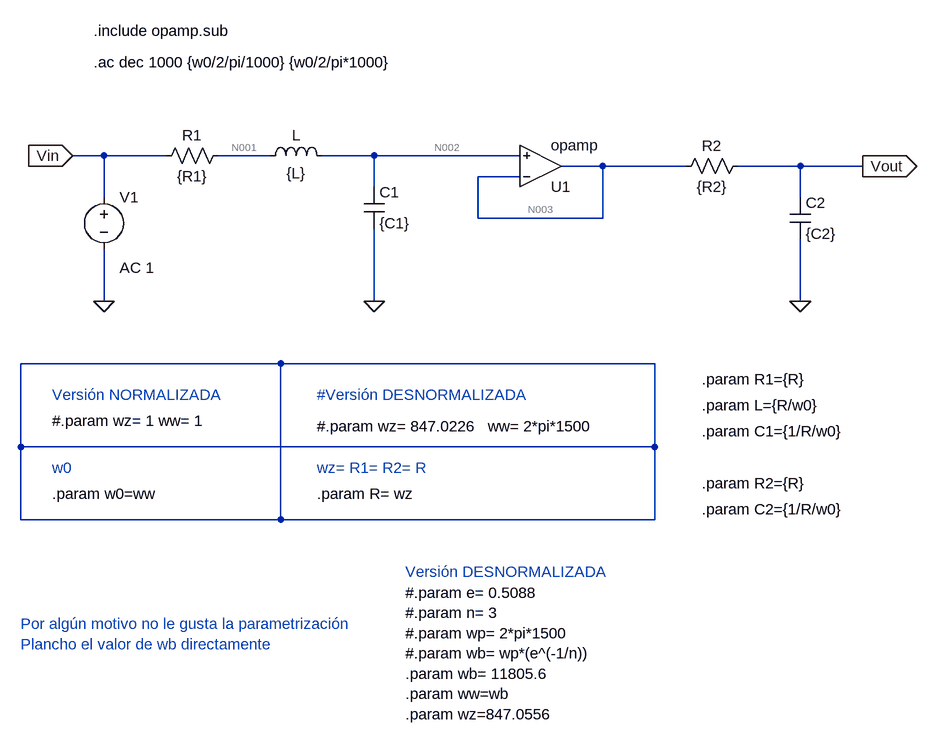
[diagram p0: schematic TS3_LTSpice_Butterworth.asc]
TS3_LTSpice_Butterworth.asc, the LTspice schematic file:
Version 4
SHEET 1 1836 888
WIRE -400 -208 -448 -208
WIRE -304 -208 -400 -208
WIRE -144 -208 -224 -208
WIRE 16 -208 -64 -208
WIRE 240 -208 16 -208
WIRE 368 -192 304 -192
WIRE 496 -192 368 -192
WIRE 672 -192 576 -192
WIRE 768 -192 672 -192
WIRE 240 -176 176 -176
WIRE 16 -160 16 -208
WIRE -400 -144 -400 -208
WIRE 672 -144 672 -192
WIRE 176 -112 176 -176
WIRE 368 -112 368 -192
WIRE 368 -112 176 -112
WIRE -400 16 -400 -64
WIRE 16 16 16 -96
WIRE 672 16 672 -80
WIRE -128 112 -528 112
WIRE 448 112 -128 112
WIRE -528 240 -528 112
WIRE 448 240 448 112
WIRE 448 240 -528 240
WIRE -528 352 -528 240
WIRE -128 352 -128 112
WIRE -128 352 -528 352
WIRE 448 352 448 240
WIRE 448 352 -128 352
FLAG 16 16 0
FLAG -400 16 0
FLAG -448 -208 Vin
IOPIN -448 -208 In
FLAG 672 16 0
FLAG 768 -192 Vout
IOPIN 768 -192 Out
SYMBOL Opamps\\opamp 272 -128 M180
SYMATTR InstName U1
SYMBOL res -208 -224 R90
WINDOW 0 0 56 VBottom 2
WINDOW 3 32 56 VTop 2
SYMATTR InstName R1
SYMATTR Value {R1}
SYMBOL cap 0 -160 R0
SYMATTR InstName C1
SYMATTR Value {C1}
SYMBOL res 592 -208 R90
WINDOW 0 0 56 VBottom 2
WINDOW 3 32 56 VTop 2
SYMATTR InstName R2
SYMATTR Value {R2}
SYMBOL cap 656 -144 R0
SYMATTR InstName C2
SYMATTR Value {C2}
SYMBOL voltage -400 -160 R0
WINDOW 123 24 124 Left 2
WINDOW 39 0 0 Left 0
SYMATTR Value2 AC 1
SYMATTR InstName V1
SYMATTR Value ""
SYMBOL ind -160 -192 R270
WINDOW 0 32 56 VTop 2
WINDOW 3 5 56 VBottom 2
SYMATTR InstName L
SYMATTR Value {L}
TEXT -416 -400 Left 2 !.include opamp.sub
TEXT -416 -352 Left 2 !.ac dec 1000 {w0/2/pi/1000} {w0/2/pi*1000}
TEXT -480 160 Left 2 ;Versión NORMALIZADA
TEXT -480 200 Left 2 !#.param wz= 1 ww= 1
TEXT -72 160 Left 2 ;#Versión DESNORMALIZADA
TEXT -72 208 Left 2 !#.param wz= 847.0226   ww= 2*pi*1500
TEXT 520 216 Left 2 !.param C1={1/R/w0}
TEXT -480 272 Left 2 ;w0
TEXT -480 312 Left 2 !.param w0=ww
TEXT -72 272 Left 2 ;wz= R1= R2= R
TEXT -72 312 Left 2 !.param R= wz
TEXT 520 336 Left 2 !.param C2={1/R/w0}
TEXT 520 136 Left 2 !.param R1={R}
TEXT 520 296 Left 2 !.param R2={R}
TEXT 520 176 Left 2 !.param L={R/w0}
TEXT 64 464 Left 2 !#.param e= 0.5088\n#.param n= 3\n#.param wp= 2*pi*1500\n#.param wb= wp*(e^(-1/n))\n.param wb= 11805.6\n.param ww=wb \n.param wz=847.0556
TEXT 64 432 Left 2 ;Versión DESNORMALIZADA
TEXT -528 512 Left 2 ;Por algún motivo no le gusta la parametrización\nPlancho el valor de wb directamente

The netlist it stands for:
* TS3_LTSpice_Butterworth.asc
XU1 N003 N002 N003 opamp Aol=100K GBW=10Meg  ; pins invin noninvin out
R1 N001 Vin {R1}
C1 N002 0 {C1}
R2 Vout N003 {R2}
C2 Vout 0 {C2}
V1 Vin 0 AC 1
L N001 N002 {L}
.include opamp.sub
.ac dec 1000 {w0/2/pi/1000} {w0/2/pi*1000}
* Versión NORMALIZADA
#.param wz= 1 ww= 1
* #Versión DESNORMALIZADA
#.param wz= 847.0226   ww= 2*pi*1500
.param C1={1/R/w0}
* w0
.param w0=ww
* wz= R1= R2= R
.param R= wz
.param C2={1/R/w0}
.param R1={R}
.param R2={R}
.param L={R/w0}
#.param e= 0.5088
#.param n= 3
#.param wp= 2*pi*1500
#.param wb= wp*(e^(-1/n))
.param wb= 11805.6
.param ww=wb
.param wz=847.0556
* Versión DESNORMALIZADA
* Por algún motivo no le gusta la parametrización
* Plancho el valor de wb directamente
.backanno
.end

* Results of the author's LTspice run, read from the files saved beside the schematic
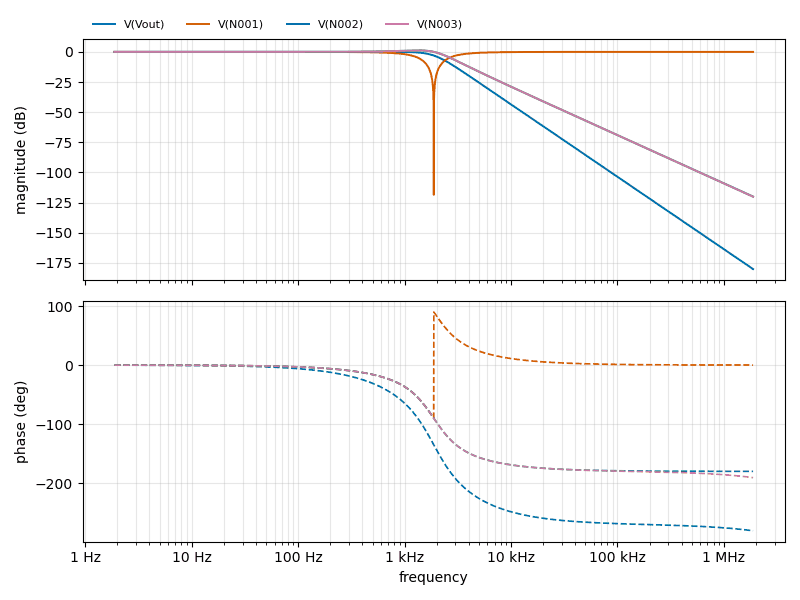
[diagram p1: AC Analysis of TS3_LTSpice_Butterworth.asc, plotted from the saved traces]
* AC Analysis, 1 run:
*   V(Vout): -0.00 dB at 1.879 Hz, -180.15 dB at 1.879 MHz, peak -0.00 dB at 1.879 Hz, 3 dB below the peak at 1.879 kHz
*   V(N001): -0.00 dB at 1.879 Hz, -0.00 dB at 1.879 MHz, peak -0.00 dB at 1.879 Hz, 3 dB below the peak at 1.161 kHz
*   V(N002): 0.00 dB at 1.879 Hz, -120.00 dB at 1.879 MHz, peak 1.25 dB at 1.327 kHz, 3 dB below the peak at 2.196 kHz
*   V(N003): -0.00 dB at 1.879 Hz, -120.15 dB at 1.879 MHz, peak 1.25 dB at 1.327 kHz, 3 dB below the peak at 2.196 kHz